# Altium project pravki.PrjPcb
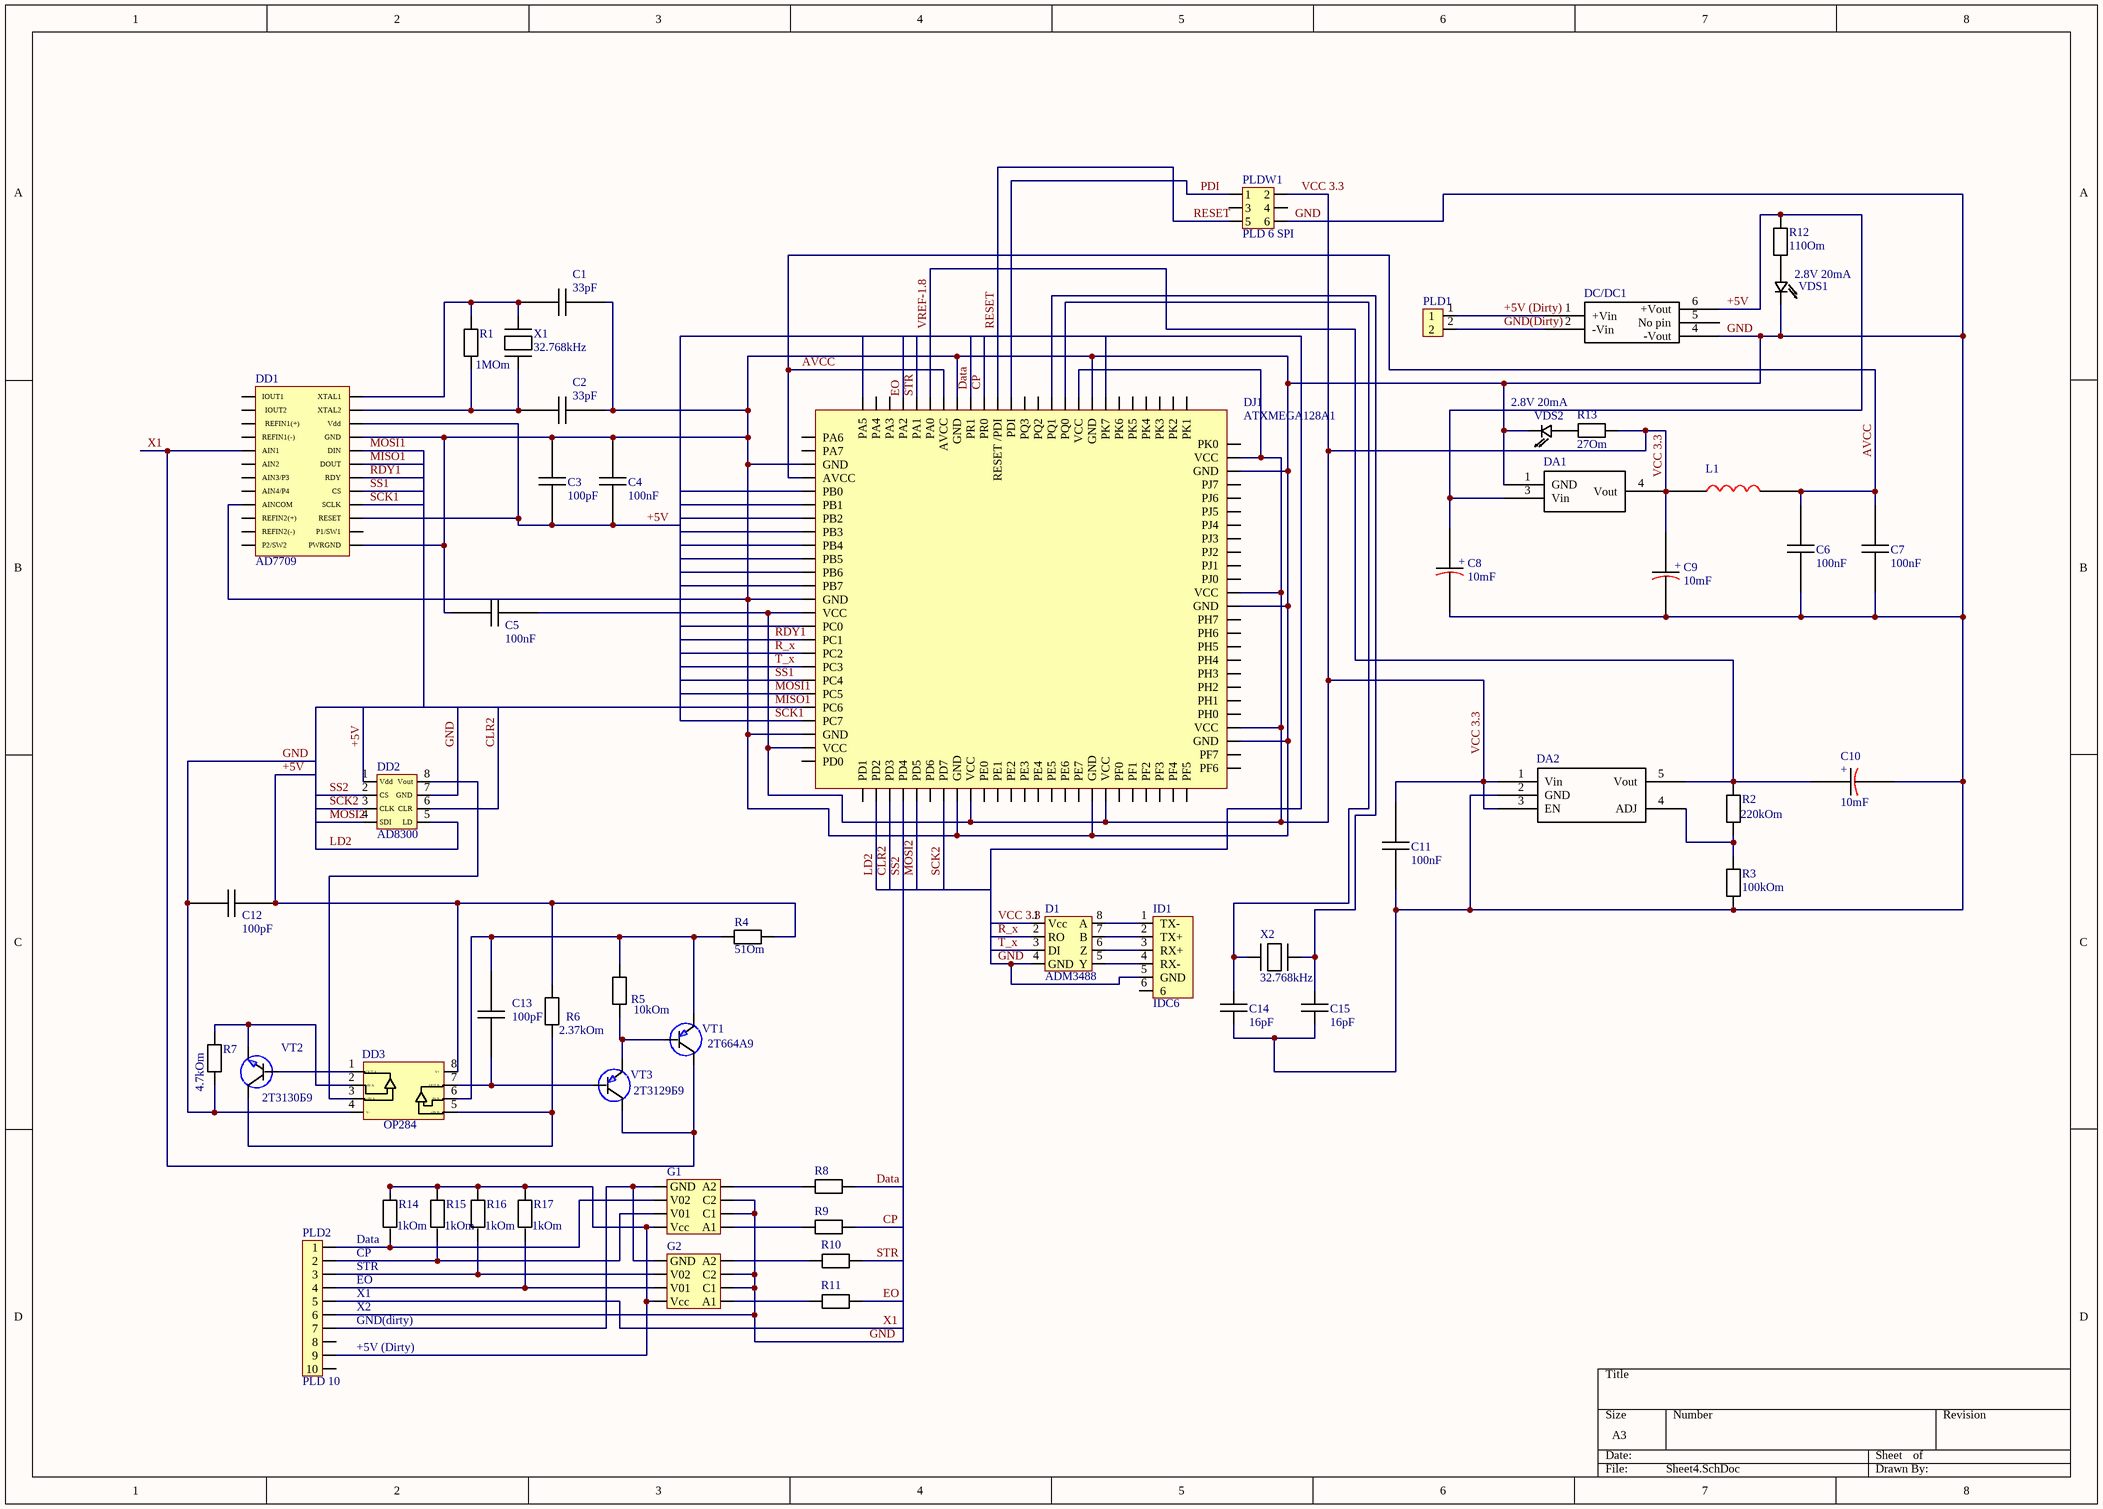
[diagram p0: Sheet4.SchDoc]
1 sheet, 54 parts. Net scope: global (net labels, ports and power ports of the same name join across sheets).
Board file: PCB3.PcbDoc

## Sheet Sheet4.SchDoc
size A3

### Parts
C1  33pF  [Cap 1206]
C2  33pF  [Cap 1206]
C3  100pF  [Cap 0805]
C4  100nF  [Cap 0805]
C5  100nF  [Cap 0805]
C6  100nF  [Cap 0805]
C7  100nF  [Cap 0805]
C8  10mF  [Cap 10mF electrolit]
C9  10mF  [Cap 10mF electrolit]
C10  10mF  [Cap 10mF electrolit]
C11  100nF  [Cap 0805]
C12  100pF  [Cap 0805]
C13  100pF  [Cap 0805]
C14  16pF  [Cap 0805]
C15  16pF  [Cap 0805]
D1  ADM3488  [ADM3488]
DA1  (no value)  [MC33269]
DA2  (no value)  [MIC5205-ADJ]
DC/DC1  (no value)  [TRACO POWER]
DD1  AD7709  [AD7709 TSSOP24]
DD2  AD8300  [SOIC8]
DD3  OP284  [SOIC8]
DJ1  ATXMEGA128A1  [ATXMEGA128A1]
G1  (no value)  [HCPL-0600/01/11/30/31/61 (HCPL-0631-000E)]
G2  (no value)  [HCPL-0600/01/11/30/31/61 (HCPL-0631-000E)]
ID1  IDC6  [IDC 6]
L1  (no value)  [Ind 10 mHe]
PLD1  (no value)  [PLS 2]
PLD2  PLD 10  [PLD 10]
PLDW1  PLD 6 SPI  [PLD 6 SPI]
R1  1MOm  [Res 1206]
R2  220kOm  [Res 0805]
R3  100kOm  [Res 0805]
R4  51Om  [Res 1206]
R5  10kOm  [Res 1206]
R6  2.37kOm  [Res 1206]
R7  4.7kOm  [Res 0805]
R8  (no value)  [Res 0805]
R9  (no value)  [Res 0805]
R10  (no value)  [Res 0805]
R11  (no value)  [Res 0805]
R12  110Om  [Res 0805]
R13  27Om  [Res 0805]
R14  1kOm  [Cap 0603]
R15  1kOm  [Cap 0603]
R16  1kOm  [Cap 0603]
R17  1kOm  [Cap 0603]
VDS1  2.8V 20mA  [Под диод (5ммх2мм)]
VDS2  2.8V 20mA  [Под диод (5ммх2мм)]
VT1  2Т664А9  [2Т3129Б9]
VT2  2Т3130Б9  [2Т3129Б9]
VT3  2Т3129Б9  [2Т3129Б9]
X1  32.768kHz  [kvarz]
X2  32.768kHz  [kvarz]

### Nets
+5V: C3.1 C4.1 C8.1 C12.2 DA1.3(Vin) DC/DC1.6(+Vout) DD1.15(RESET) DD1.22(Vdd) DD2.1(Vdd) DD3.8(V+) R4.2 R6.2 R12.2
+5V (Dirty): DC/DC1.1(+Vin) PLD1.1
AVCC: C6.2 C7.2 DJ1.H1(AVCC) DJ1.K4(AVCC) L1.2
CLR2: DD2.6(CLR) DJ1.H10(PD3)
CP: DJ1.F2(PR0) R9.2
Data: DJ1.F1(PR1) R8.2
EO: DJ1.H2(PA2) R11.2
GND: C1.2 C2.2 C3.2 C4.2 C5.1 C6.1 C7.1 C8.2 C9.2 C10.2 C11.1 C12.1 C14.1 C15.1 D1.4(GND) DA1.1(GND) DA2.2(GND) DC/DC1.4(-Vout) DD1.9(AINCOM) DD1.13(PWRGND) DD1.21(GND) DD2.7(GND) DD3.4(V-) DJ1.A3(GND) DJ1.A6(GND) DJ1.A8(GND) DJ1.D1(GND) DJ1.D10(GND) DJ1.G1(GND) DJ1.G10(GND) DJ1.K3(GND) DJ1.K7(GND) DJ1.K9(GND) G1.2(C1) G1.3(C2) G2.2(C1) G2.3(C2) ID1.5(GND) PLD2.6 PLDW1.6 R3.1 R7.1 VDS1.2 VDS2.2
GND(Dirty): DC/DC1.2(-Vin) PLD1.2
LD2: DD2.5(LD) DJ1.J9(PD2)
MISO1: DD1.19(DOUT) DJ1.G7(PC6)
MOSI1: DD1.20(DIN) DJ1.H7(PC5)
MOSI2: DD2.4(SDI) DJ1.H8(PD5)
PDI: DJ1.F4(PDI) PLDW1.1
R_x: D1.2(RO) DJ1.F6(PC2)
RDY1: DD1.18(RDY) DJ1.G6(PC1)
RESET: DJ1.F3(RESET_/PDI) PLDW1.5
SCK1: DD1.16(SCLK) DJ1.J8(PC7)
SCK2: DD2.3(CLK) DJ1.G8(PD7)
SS1: DD1.17(CS) DJ1.J7(PC4)
SS2: DD2.2(CS) DJ1.H9(PD4)
STR: DJ1.G2(PA1) R10.2
T_x: D1.3(DI) DJ1.J6(PC3)
VCC 3.3: C5.2 C9.1 C11.2 D1.1(Vcc) DA1.4(Vout) DA2.1(Vin) DA2.3(EN) DJ1.A2(VCC) DJ1.A5(VCC) DJ1.A9(VCC) DJ1.C1(VCC) DJ1.C10(VCC) DJ1.F10(VCC) DJ1.K6(VCC) DJ1.K8(VCC) L1.1 PLDW1.2 R13.1
VREF-1.8: C10.1 DA2.5(Vout) DJ1.J1(PA0) R2.2
X1: DD1.5(AIN1) PLD2.5 VT1.1 VT3.2
NetC1_1: C1.1 DD1.24(XTAL1) R1.2 X1.2
NetC2_1: C2.1 DD1.23(XTAL2) R1.1 X1.1
NetC13_1: C13.1 DD3.6(-IN_B) R4.1 R5.2 VT1.3
NetC13_2: C13.2 DD3.7(OUT_B) VT3.1
NetC14_2: C14.2 DJ1.E1(PQ0) X2.1
NetC15_2: C15.2 DJ1.E2(PQ1) X2.2
NetD1_5: D1.5(Y) ID1.4(RX-)
NetD1_6: D1.6(Z) ID1.3(RX+)
NetD1_7: D1.7(B) ID1.2(TX+)
NetD1_8: D1.8(A) ID1.1(TX-)
NetDA2_4: DA2.4(ADJ) R2.1 R3.2
NetDD2_8: DD2.8(Vout) DD3.3(+IN_A)
NetDD3_1: DD3.1(OUT_A) VT2.1
NetDD3_2: DD3.2(-IN_A) R7.2 VT2.3
NetDD3_5: DD3.5(+IN_B) R6.1 VT2.2
NetG1_1: G1.1(A1) R9.1
NetG1_4: G1.4(A2) R8.1
NetG1_5: G1.5(GND) G2.5(GND) PLD2.7
NetG1_6: G1.6(V02) PLD2.1 R14.1
NetG1_7: G1.7(V01) PLD2.2 R15.1
NetG1_8: G1.8(Vcc) G2.8(Vcc) PLD2.9 R14.2 R15.2 R16.2 R17.2
NetG2_1: G2.1(A1) R11.1
NetG2_4: G2.4(A2) R10.1
NetG2_6: G2.6(V02) PLD2.3 R16.1
NetG2_7: G2.7(V01) PLD2.4 R17.1
NetR5_1: R5.1 VT1.2 VT3.3
NetR12_1: R12.1 VDS1.1
NetR13_2: R13.2 VDS2.1

Not connected (* = marked no-connect by the designer): DC/DC1 5(No_pin); DD1 1(IOUT1) 2(IOUT2) 3(REFIN1(+)) 4(REFIN1(-)) 6(AIN2) 7(AIN3/P3) 8(AIN4/P4) 10(REFIN2(+)) 11(REFIN2(-)) 12(P2/SW2) 14(P1/SW1); DJ1 A1(PK0) A4(PJ3) A7(PH1) A10(PF7) B1(PK3) B2(PK2) B3(PK1) B4(PJ4) B5(PH7) B6(PH4) B7(PH2) B8(PH0) B9(PF6) B10(PF5) C2(PK5) C3(PK4) C4(PJ5) C5(PJ0) C6(PH5) C7(PH3) C8(PF2) C9(PF3) D2(PK6) D3(PK7) D4(PJ6) D5(PJ1) D6(PH6) D7(PF0) D8(PF1) D9(PF4) E3(PQ2) E4(PJ7) E5(PJ2) E6(PE7) E7(PE6) E8(PE5) E9(PE4) E10(PE3) F5(PQ3) F7(PE2) F8(PE1) F9(PE0) G3(PA4) G4(PB3) G5(PB4) G9(PD6) H3(PA5) H4(PB2) H5(PB5) H6(PC0) J2(PA3) J3(PB0) J4(PB1) J5(PB6) J10(PD1) K1(PA6) K2(PA7) K5(PB7) K10(PD0); ID1 6; PLD2 8 10; PLDW1 3 4

### Notes on the sheet
- (near R14) Data
- CP
- STR
- EO
- (near PLD2) X1
- (near PLD2) X2
- (near PLD2) GND(dirty)
- (near PLD2) +5V (Dirty)
- (in symbol Cap 10mF electrolit) +

### Library data of the parts
C1 C2 = Cap 33pF
C3 = Cap 100 pF
C4-C7 C11 = cap 100nF
C8-C10 = Cap 10mF electrolit
C12 C13 = Cap 100pF
C14 C15 = Cap 22pF
DA1 = MC33269
DA2 = MIC5205-ADJ
DC/DC1 = TRACO POWER(5V)
G1 G2 = Оптопара
L1 = Ind 10 mHe
PLD1 = PLS 2
R1 = RES 1MOm
R2 R3 = Res 100kOm
R4 = RES 51Om
R5 = RES 10kOm SMD1206
R6 = RES 2.37kOm
R7 = RES 4.6kOm
R8-R11 = Res 100 Om
R12 = Res 110Om
R13 = Res 25Om
R14-R17 = Res 1kOm
VDS1 VDS2 = Светодиод